# Altium schematic sheet STM32_Breakout.SchDoc
size 558 x 431 mm
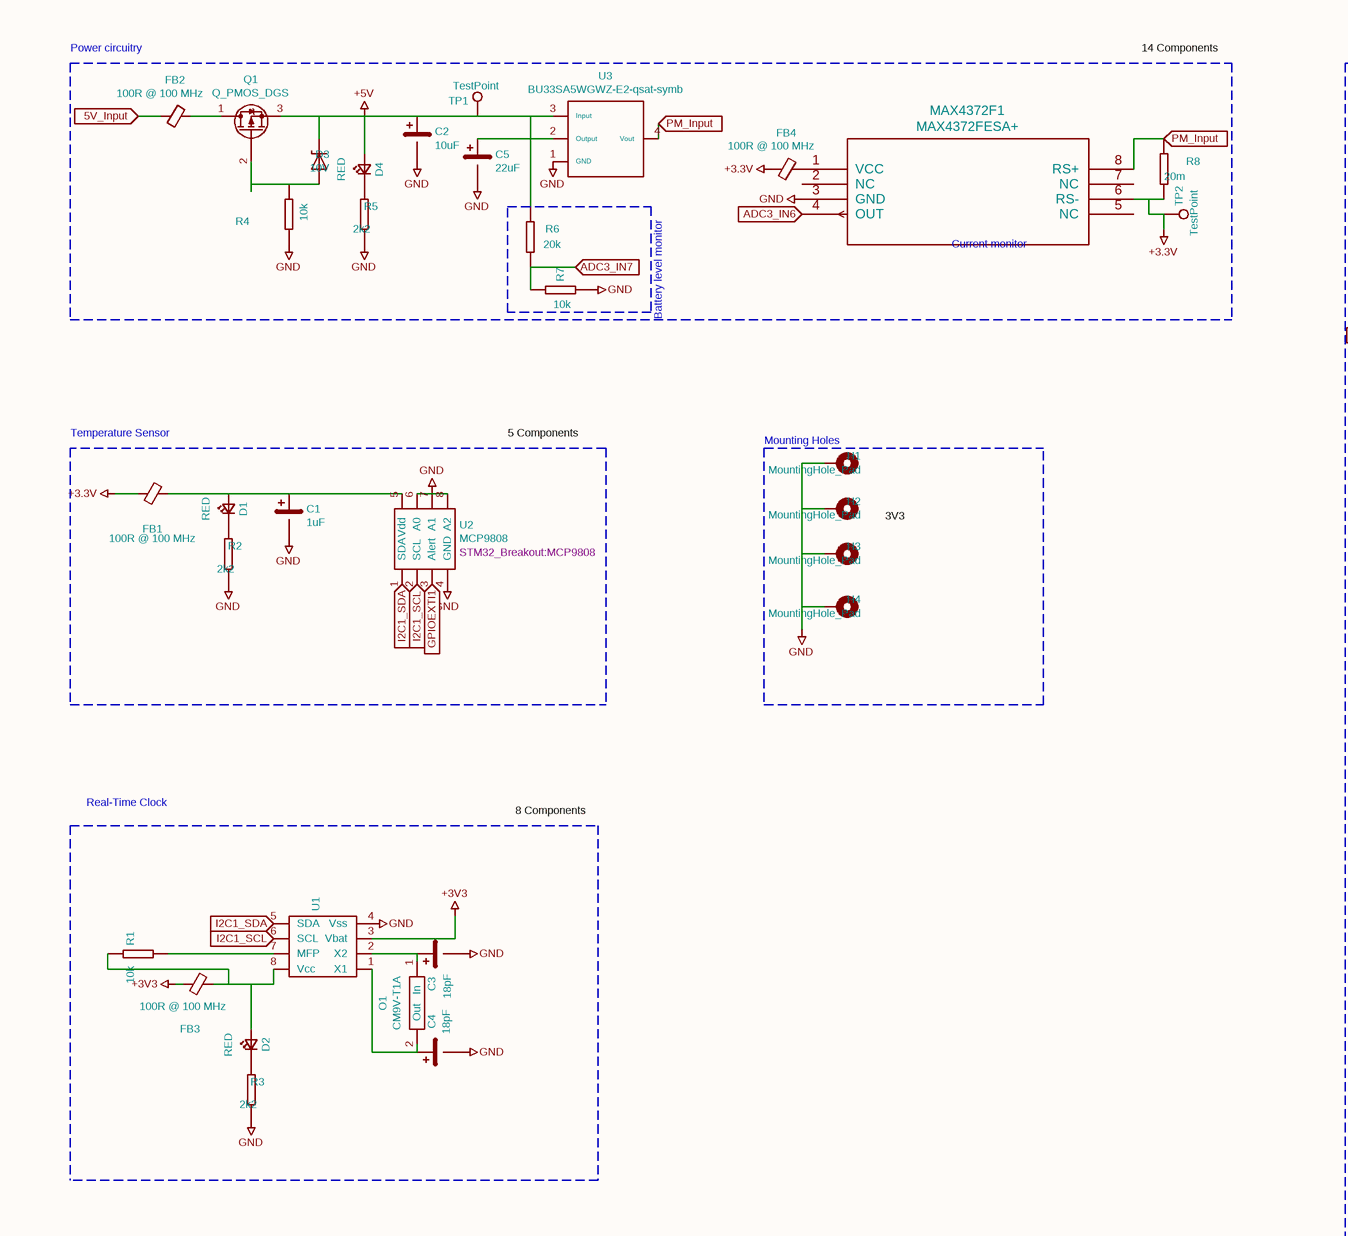
[diagram p0: STM32_Breakout.SchDoc, top left]
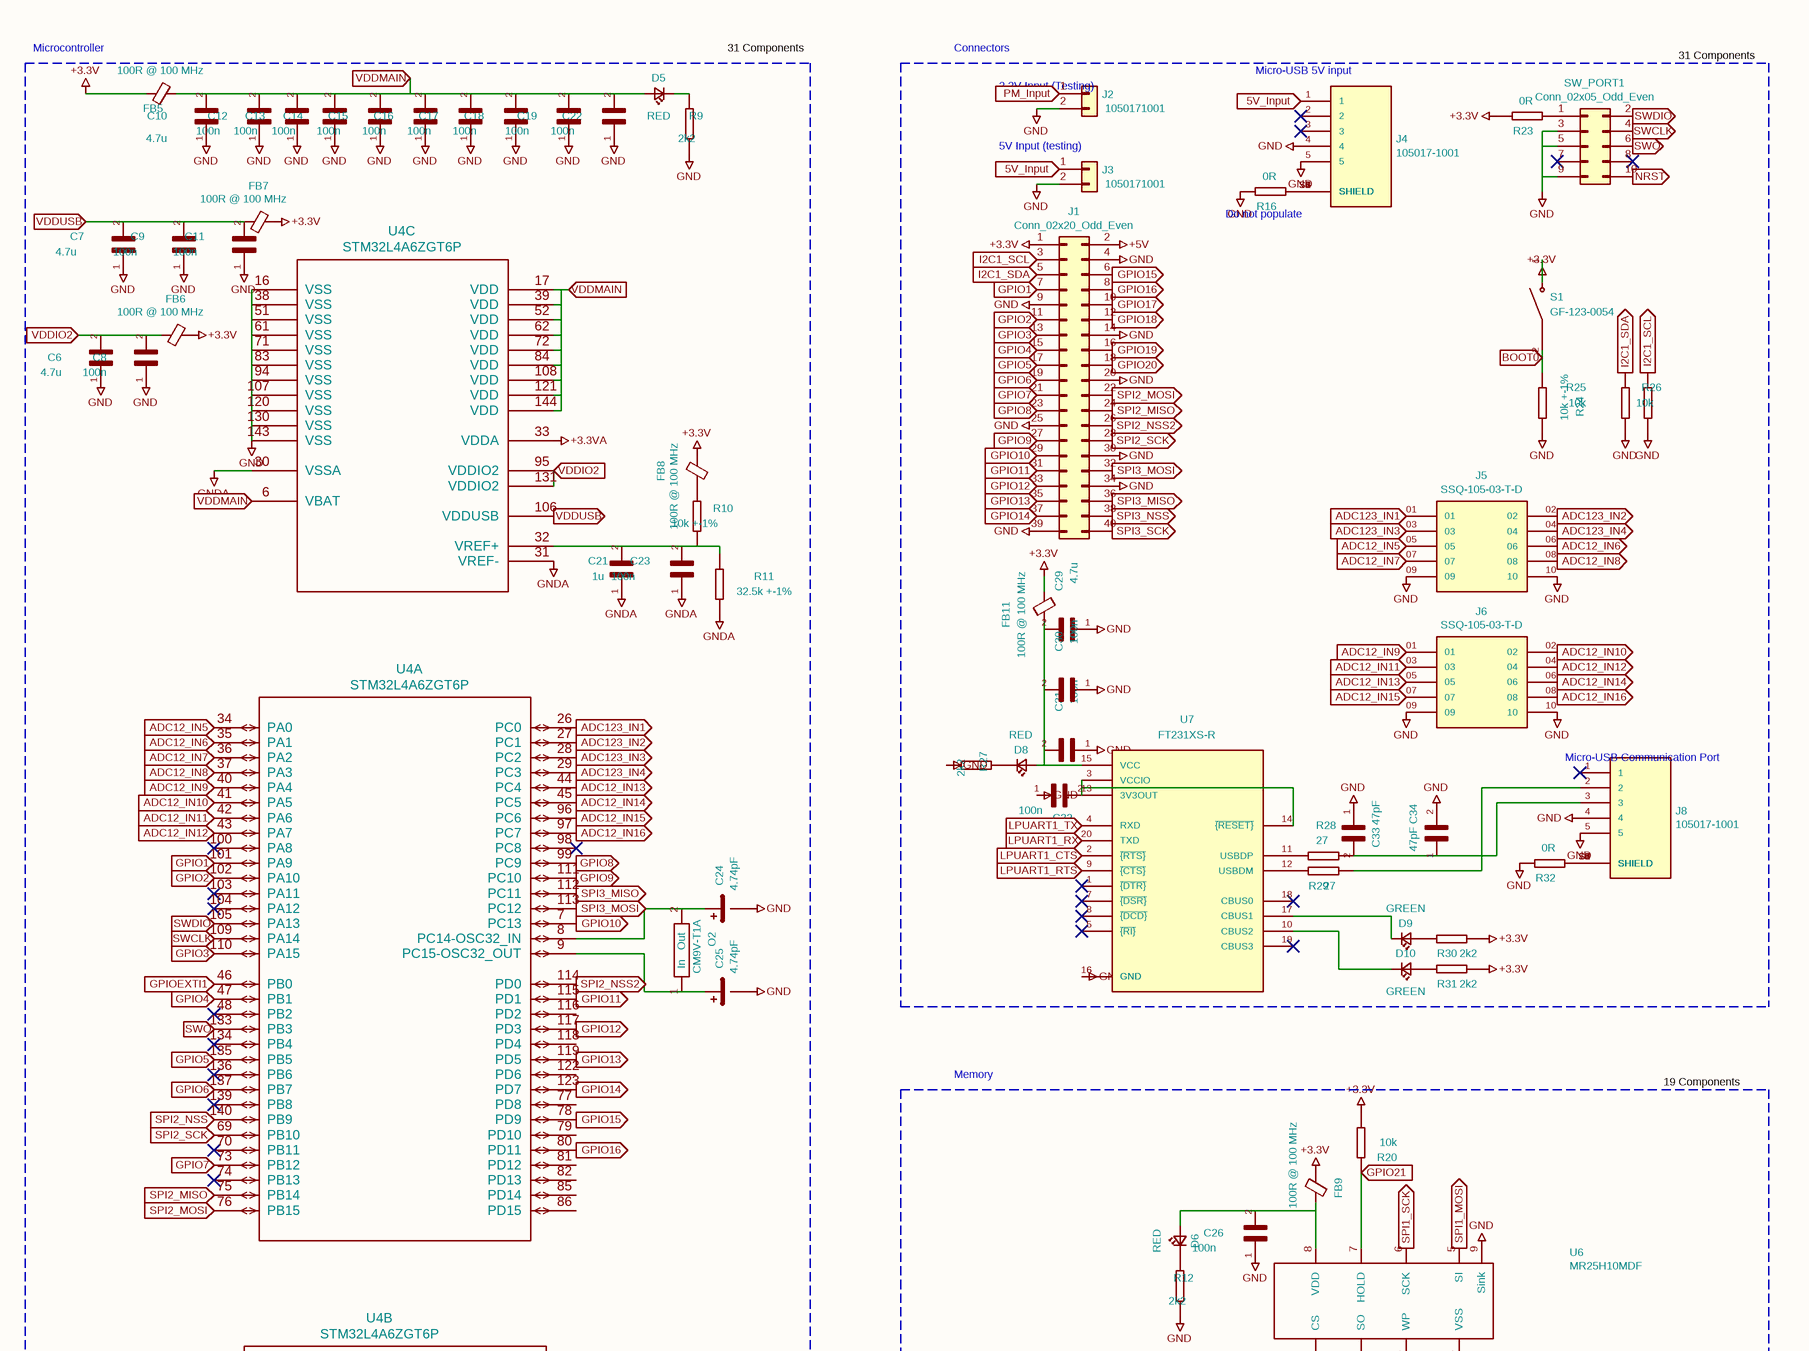
[diagram p1: STM32_Breakout.SchDoc, top right]
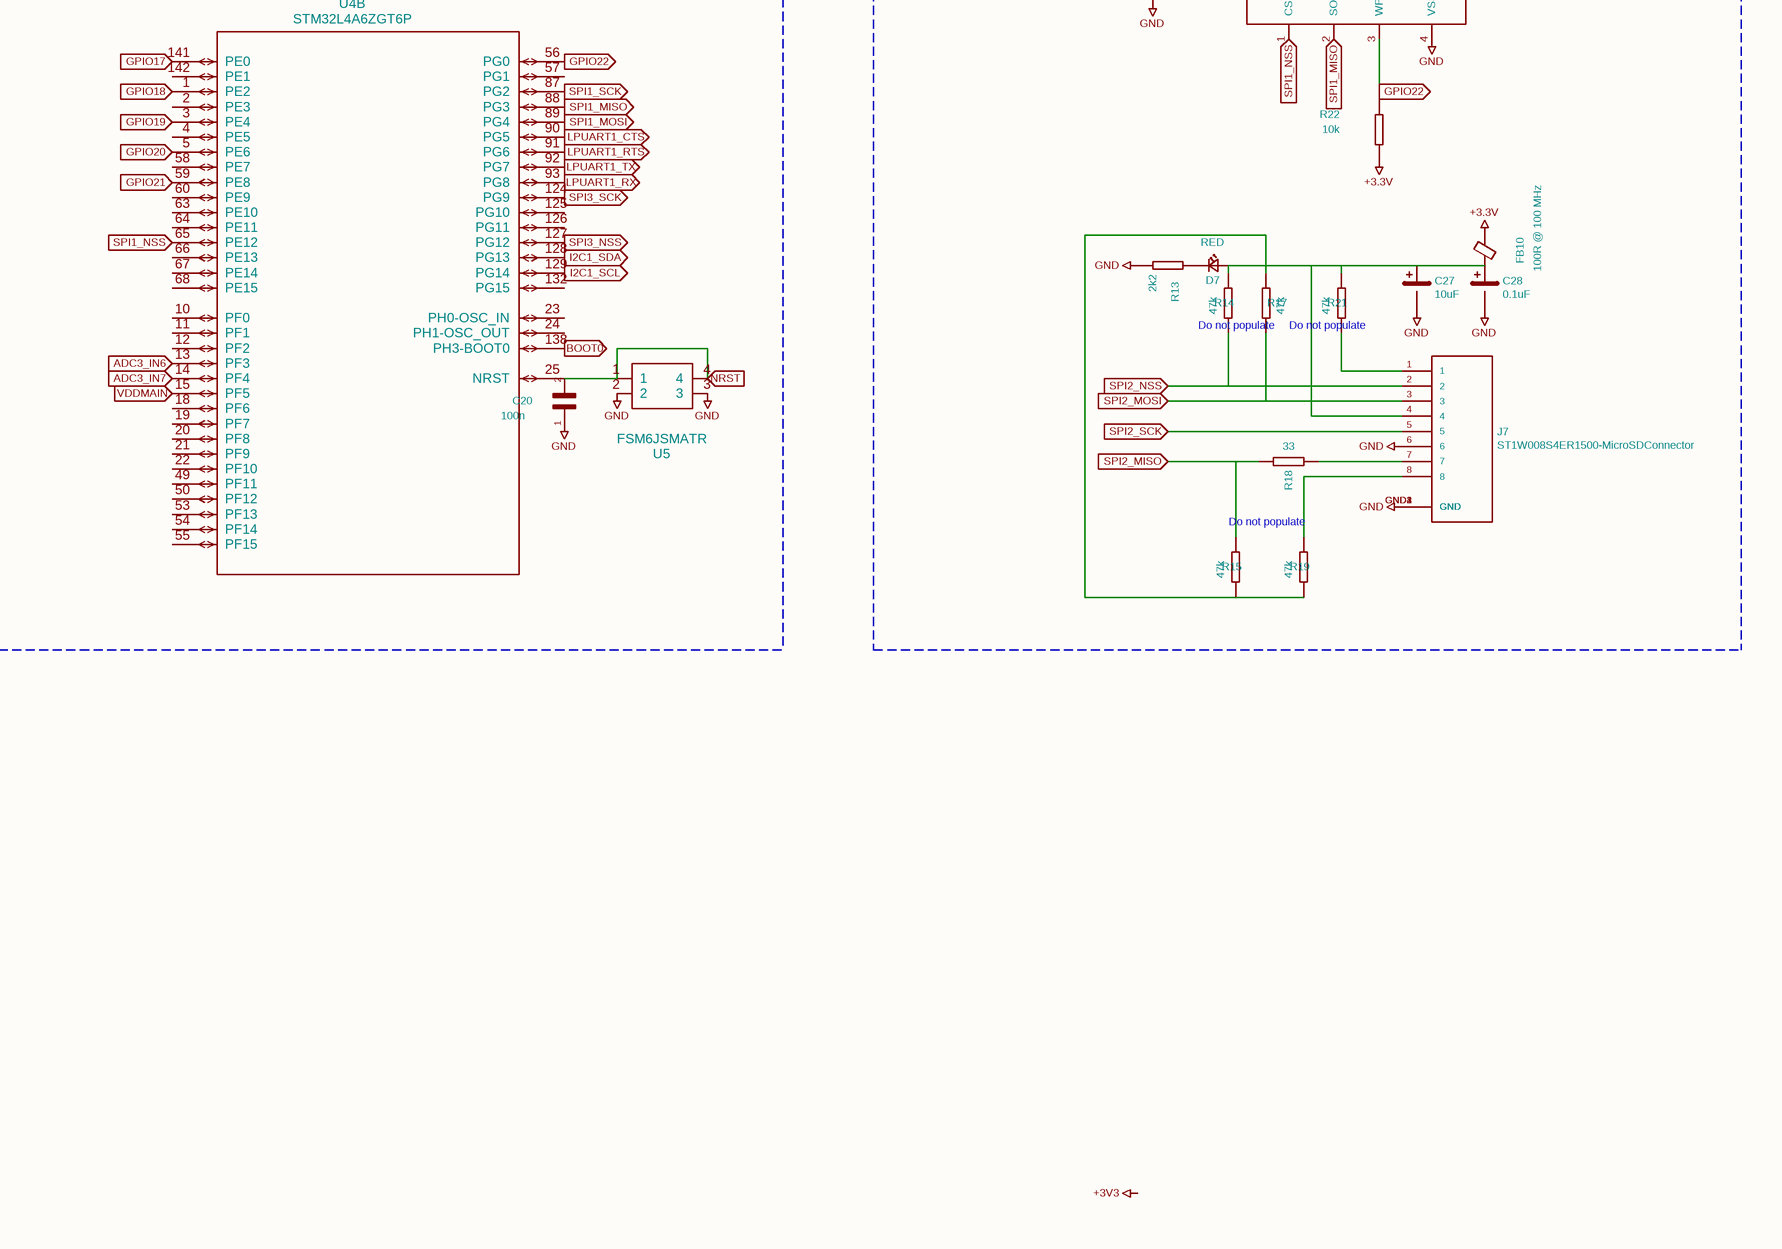
[diagram p2: STM32_Breakout.SchDoc, bottom right]

## Parts
C1  1uF  [CAPC1608X90]
C2  10uF  [CAPC1608X90]
C3  18pF  [CAPC1608X90]
C4  18pF  [CAPC1608X90]
C5  22uF  [CAPC1608X90]
C6  4.7u  [CAPC1608X90]
C7  4.7u  [CAPC1608X90]
C8  100n  [CAPC1608X90]
C9  100n  [CAPC1608X90]
C10  4.7u  [CAPC1608X90]
C11  100n  [CAPC1608X90]
C12  100n  [CAPC1608X90]
C13  100n  [CAPC1608X90]
C14  100n  [CAPC1608X90]
C15  100n  [CAPC1608X90]
C16  100n  [CAPC1608X90]
C17  100n  [CAPC1608X90]
C18  100n  [CAPC1608X90]
C19  100n  [CAPC1608X90]
C20  100n  [CAPC1608X90]
C21  1u  [CAPC1608X90]
C22  100n  [CAPC1608X90]
C23  100n  [CAPC1608X90]
C24  4.74pF  [CAPC1608X90]
C25  4.74pF  [CAPC1608X90]
C26  100n  [CAPC1608X90]
C27  10uF  [CAPC1608X90]
C28  0.1uF  [CAPC1608X90]
C29  4.7u  [CAPC1608X90]
C30  100n  [CAPC1608X90]
C31  100n  [CAPC1608X90]
C32  100n  [CAPC1608X90]
C33  47pF  [CAPC1608X90]
C34  47pF  [CAPC1608X90]
D1  RED  [LED_0603_1608Metric_Pad1.05x0.95mm_HandSolder]
D2  RED  [LED_0603_1608Metric_Pad1.05x0.95mm_HandSolder]
D3  10V  [SOT91P240X110-3N]
D4  RED  [LED_0603_1608Metric_Pad1.05x0.95mm_HandSolder]
D5  RED  [LED_0603_1608Metric_Pad1.05x0.95mm_HandSolder]
D6  RED  [LED_0603_1608Metric_Pad1.05x0.95mm_HandSolder]
D7  RED  [LED_0603_1608Metric_Pad1.05x0.95mm_HandSolder]
D8  RED  [LED_0603_1608Metric_Pad1.05x0.95mm_HandSolder]
D9  GREEN  [LED_0603_1608Metric_Pad1.05x0.95mm_HandSolder]
D10  GREEN  [LED_0603_1608Metric_Pad1.05x0.95mm_HandSolder]
FB1  100R @ 100 MHz  [INDUC1607X60N]
FB2  100R @ 100 MHz  [INDUC1607X60N]
FB3  100R @ 100 MHz  [INDUC1607X60N]
FB4  100R @ 100 MHz  [INDUC1607X60N]
FB5  100R @ 100 MHz  [INDUC1607X60N]
FB6  100R @ 100 MHz  [INDUC1607X60N]
FB7  100R @ 100 MHz  [INDUC1607X60N]
FB8  100R @ 100 MHz  [INDUC1607X60N]
FB9  100R @ 100 MHz  [INDUC1607X60N]
FB10  100R @ 100 MHz  [INDUC1607X60N]
FB11  100R @ 100 MHz  [INDUC1607X60N]
H1  MountingHole_Pad  [MountingHole_4.3mm_M4_Pad_Via]
H2  MountingHole_Pad  [MountingHole_4.3mm_M4_Pad_Via]
H3  MountingHole_Pad  [MountingHole_4.3mm_M4_Pad_Via]
H4  MountingHole_Pad  [MountingHole_4.3mm_M4_Pad_Via]
J1  Conn_02x20_Odd_Even  [PinHeader_2x20_P2.54mm_Vertical]
J2  1050171001  [PinHeader_1x02_P2.54mm_Vertical]
J3  1050171001  [PinHeader_1x02_P2.54mm_Vertical]
J4  105017-1001  [MOLEX_105017-1001]
J5  SSQ-105-03-T-D  [SAMTEC_SSQ-105-03-T-D]
J6  SSQ-105-03-T-D  [SAMTEC_SSQ-105-03-T-D]
J7  ST1W008S4ER1500-MicroSDConnector  [JAE_ST1W008S4ER1500]
J8  105017-1001  [MOLEX_105017-1001]
MAX4372F1  MAX4372FESA+  [SOIC127P600X175-8N]
O1  CM9V-T1A  [CM9V-T1A]
O2  CM9V-T1A  [CM9V-T1A]
Q1  Q_PMOS_DGS  [SOT91P240X110-3N]
R1  10k  [RESC1607X60N]
R2  2k2  [RESC1607X60N]
R3  2k2  [RESC1607X60N]
R4  10k  [RESC1607X60N]
R5  2k2  [RESC1607X60N]
R6  20k  [RESC1607X60N]
R7  10k  [RESC1607X60N]
R8  20m  [RESC1607X60N]
R9  2k2  [RESC1607X60N]
R10  10k +-1%  [RESC1607X60N]
R11  32.5k +-1%  [RESC1607X60N]
R12  2k2  [RESC1607X60N]
R13  2k2  [RESC1607X60N]
R14  47k  [RESC1607X60N]
R15  47k  [RESC1607X60N]
R16  0R  [RESC1607X60N]
R17  47k  [RESC1607X60N]
R18  33  [RESC1607X60N]
R19  47k  [RESC1607X60N]
R20  10k  [RESC1607X60N]
R21  47k  [RESC1607X60N]
R22  10k  [RESC1607X60N]
R23  0R  [RESC1607X60N]
R24  10k +-1%  [RESC1607X60N]
R25  10k  [RESC1607X60N]
R26  10k  [RESC1607X60N]
R27  2k2  [RESC1607X60N]
R28  27  [RESC1607X60N]
R29  27  [RESC1607X60N]
R30  2k2  [RESC1607X60N]
R31  2k2  [RESC1607X60N]
R32  0R  [RESC1607X60N]
S1  GF-123-0054  [SW_GF-123-0054]
SW_PORT1  Conn_02x05_Odd_Even  [PinHeader_2x05_P1.27mm_Vertical_SMD]
TP1  TestPoint  [TestPoint_Pad_D2.0mm]
TP2  TestPoint  [TestPoint_Pad_D2.0mm]
U1  MCP7940NT-I_MS  [MCP7940NT-I-MS]  (value not drawn)
U2  Footprint: STM32_Breakout:MCP9808  [MCP9808]  (hidden comment: MCP9808)
U3  BU33SA5WGWZ-E2-qsat-symb  [BU33SA5WGWZ-E2]
U4  STM32L4A6ZGT6P  [LQFP144-20x20mm]  (parts A,B,C of 3)
U5  FSM6JSMATR  [FSM6JSMATR]
U6  MR25H10MDF  [SON65P300X300X95-8N]
U7  FT231XS-R  [SOP63P599X175-20N]

## Blocks framed on the sheet
Microcontroller /: C6-C25 D5 FB5-FB8 O2 R9-R11 U4 U5
Temperature Sensor /: C1 D1 FB1 R2 U2
Mounting Holes /: H1-H4

## Ports
5V_Input (in), ADC3_IN6 (in), ADC3_IN7 (in), ADC12_IN5 (in), ADC12_IN6 (in), ADC12_IN7 (in), ADC12_IN8 (in), ADC12_IN9 (in), ADC12_IN10 (in), ADC12_IN11 (in), ADC12_IN12 (in), ADC12_IN13 (in), ADC12_IN14 (in), ADC12_IN15 (in), ADC12_IN16 (in), ADC123_IN1 (in), ADC123_IN2 (in), ADC123_IN3 (in), ADC123_IN4 (in), BOOT0 (in), GPIO1 (in), GPIO2 (in), GPIO3 (in), GPIO4 (in), GPIO5 (in), GPIO6 (in), GPIO7 (in), GPIO8 (in), GPIO9 (in), GPIO10 (in), GPIO11 (in), GPIO12 (in), GPIO13 (in), GPIO14 (in), GPIO15 (in), GPIO16 (in), GPIO17 (in), GPIO18 (in), GPIO19 (in), GPIO20 (in), GPIO21 (in), GPIO22 (in), GPIOEXTI1 (in), I2C1_SCL (in), I2C1_SDA (in), LPUART1_CTS (in), LPUART1_RTS (in), LPUART1_RX (in), LPUART1_TX (in), NRST (in), PM_Input (in), SPI1_MISO (in), SPI1_MOSI (in), SPI1_NSS (in), SPI1_SCK (in), SPI2_MISO (in), SPI2_MOSI (in), SPI2_NSS2 (in), SPI2_NSS (in), SPI2_SCK (in), SPI3_MISO (in), SPI3_MOSI (in), SPI3_NSS (in), SPI3_SCK (in), SWCLK (in), SWDIO (in), SWO (in), VDDIO2 (in), VDDMAIN (in), VDDUSB (in)

## Nets
+3.3V: FB1.1 FB4.2 FB5.2 FB6.1 FB7.1 FB8.1 FB9.1 FB10.2 FB11.1 J1.1(Pin_1) MAX4372F1.6(RS-) R8.2 R20.2 R22.2 R23.2 R30.2 R31.2 S1.1 TP2.1
+3.3VA: U4.33(VDDA)
+3V3: FB3.1 U1.3(Vbat)
+5V: C2.1 D3.3(A) D4.2(A) J1.2(Pin_2) Q1.3(S) R6.2 TP1.1 U3.3(Input)
GND: C1.2 C2.2 C3.2 C4.2 C5.2 C6.1 C7.1 C8.1 C9.1 C10.1 C11.1 C12.1 C13.1 C14.1 C15.1 C16.1 C17.1 C18.1 C19.1 C20.1 C22.1 C24.2 C25.2 C26.1 C27.2 C28.2 C29.1 C30.1 C31.1 C32.1 C33.1 C34.2 H1.1 H2.1 H3.1 H4.1 J1.4(Pin_4) J1.9(Pin_9) J1.14(Pin_14) J1.20(Pin_20) J1.25(Pin_25) J1.30(Pin_30) J1.34(Pin_34) J1.39(Pin_39) J2.2(Pin_2) J3.2(Pin_2) J4.4 J4.5 J5.09 J5.10 J6.09 J6.10 J7.6 J7.GND1(GND) J7.GND2(GND) J7.GND3(GND) J7.GND4(GND) J8.4 J8.5 MAX4372F1.3(GND) R2.2 R3.2 R4.1 R5.2 R7.2 R9.2 R12.2 R13.2 R16.2 R24.2 R25.2 R26.2 R27.2 R32.2 SW_PORT1.3(Pin_3) SW_PORT1.5(Pin_5) SW_PORT1.9(Pin_9) U1.4(Vss) U2.4(GND) U2.6(A0) U2.7(A1) U2.8(A2) U3.1(GND) U4.16(VSS) U4.38(VSS) U4.51(VSS) U4.61(VSS) U4.71(VSS) U4.83(VSS) U4.94(VSS) U4.107(VSS) U4.120(VSS) U4.130(VSS) U4.143(VSS) U5.2 U5.3 U6.4(VSS) U6.9(Sink) U7.6(GND) U7.16(GND)
GNDA: C21.1 C23.1 R11.1 U4.30(VSSA) U4.31(VREF-)
5V_Input: FB2.2 J3.1(Pin_1) J4.1 ; port 5V_Input
ADC3_IN6: MAX4372F1.4(OUT) U4.13(PF3) ; port ADC3_IN6
ADC3_IN7: R6.1 R7.1 U4.14(PF4) ; port ADC3_IN7
ADC12_IN5: J5.05 U4.34(PA0) ; port ADC12_IN5
ADC12_IN6: J5.06 U4.35(PA1) ; port ADC12_IN6
ADC12_IN7: J5.07 U4.36(PA2) ; port ADC12_IN7
ADC12_IN8: J5.08 U4.37(PA3) ; port ADC12_IN8
ADC12_IN9: J6.01 U4.40(PA4) ; port ADC12_IN9
ADC12_IN10: J6.02 U4.41(PA5) ; port ADC12_IN10
ADC12_IN11: J6.03 U4.42(PA6) ; port ADC12_IN11
ADC12_IN12: J6.04 U4.43(PA7) ; port ADC12_IN12
ADC12_IN13: J6.05 U4.44(PC4) ; port ADC12_IN13
ADC12_IN14: J6.06 U4.45(PC5) ; port ADC12_IN14
ADC12_IN15: J6.07 U4.96(PC6) ; port ADC12_IN15
ADC12_IN16: J6.08 U4.97(PC7) ; port ADC12_IN16
ADC123_IN1: J5.01 U4.26(PC0) ; port ADC123_IN1
ADC123_IN2: J5.02 U4.27(PC1) ; port ADC123_IN2
ADC123_IN3: J5.03 U4.28(PC2) ; port ADC123_IN3
ADC123_IN4: J5.04 U4.29(PC3) ; port ADC123_IN4
BOOT0: R24.1 S1.2 U4.138(PH3-BOOT0) ; port BOOT0
GPIO1: J1.7(Pin_7) U4.101(PA9) ; port GPIO1
GPIO2: J1.11(Pin_11) U4.102(PA10) ; port GPIO2
GPIO3: J1.13(Pin_13) U4.110(PA15) ; port GPIO3
GPIO4: J1.15(Pin_15) U4.47(PB1) ; port GPIO4
GPIO5: J1.17(Pin_17) U4.135(PB5) ; port GPIO5
GPIO6: J1.19(Pin_19) U4.137(PB7) ; port GPIO6
GPIO7: J1.21(Pin_21) U4.73(PB12) ; port GPIO7
GPIO8: J1.23(Pin_23) U4.99(PC9) ; port GPIO8
GPIO9: J1.27(Pin_27) U4.111(PC10) ; port GPIO9
GPIO10: J1.29(Pin_29) U4.7(PC13) ; port GPIO10
GPIO11: J1.31(Pin_31) U4.115(PD1) ; port GPIO11
GPIO12: J1.33(Pin_33) U4.117(PD3) ; port GPIO12
GPIO13: J1.35(Pin_35) U4.119(PD5) ; port GPIO13
GPIO14: J1.37(Pin_37) U4.123(PD7) ; port GPIO14
GPIO15: J1.6(Pin_6) U4.78(PD9) ; port GPIO15
GPIO16: J1.8(Pin_8) U4.80(PD11) ; port GPIO16
GPIO17: J1.10(Pin_10) U4.141(PE0) ; port GPIO17
GPIO18: J1.12(Pin_12) U4.1(PE2) ; port GPIO18
GPIO19: J1.16(Pin_16) U4.3(PE4) ; port GPIO19
GPIO20: J1.18(Pin_18) U4.5(PE6) ; port GPIO20
GPIO21: R20.1 U4.59(PE8) U6.7(HOLD) ; port GPIO21
GPIO22: R22.1 U4.56(PG0) U6.3(WP) ; port GPIO22
GPIOEXTI1: U2.3(Alert) U4.46(PB0) ; port GPIOEXTI1
I2C1_SCL: J1.3(Pin_3) R26.1 U1.6(SCL) U2.2(SCL) U4.129(PG14) ; port I2C1_SCL
I2C1_SDA: J1.5(Pin_5) R25.1 U1.5(SDA) U2.1(SDA) U4.128(PG13) ; port I2C1_SDA
LPUART1_CTS: U4.90(PG5) U7.2(~{{RTS}}) ; port LPUART1_CTS
LPUART1_RTS: U4.91(PG6) U7.9(~{{CTS}}) ; port LPUART1_RTS
LPUART1_RX: U4.93(PG8) U7.20(TXD) ; port LPUART1_RX
LPUART1_TX: U4.92(PG7) U7.4(RXD) ; port LPUART1_TX
NRST: C20.2 SW_PORT1.10(Pin_10) U4.25(NRST) U5.1 U5.4 ; port NRST
PM_Input: J2.1(Pin_1) MAX4372F1.8(RS+) R8.1 U3.4(Vout) ; port PM_Input
SPI1_MISO: U4.88(PG3) U6.2(SO) ; port SPI1_MISO
SPI1_MOSI: U4.89(PG4) U6.5(SI) ; port SPI1_MOSI
SPI1_NSS: U4.65(PE12) U6.1(CS) ; port SPI1_NSS
SPI1_SCK: U4.87(PG2) U6.6(SCK) ; port SPI1_SCK
SPI2_MISO: J1.24(Pin_24) R15.1 R18.2 U4.75(PB14) ; port SPI2_MISO
SPI2_MOSI: J1.22(Pin_22) J7.3 R17.2 U4.76(PB15) ; port SPI2_MOSI
SPI2_NSS: J7.2 R14.2 U4.140(PB9) ; port SPI2_NSS
SPI2_NSS2: J1.26(Pin_26) U4.114(PD0) ; port SPI2_NSS2
SPI2_SCK: J1.28(Pin_28) J7.5 U4.69(PB10) ; port SPI2_SCK
SPI3_MISO: J1.36(Pin_36) U4.112(PC11) ; port SPI3_MISO
SPI3_MOSI: C24.1 J1.32(Pin_32) O2.2(Out) U4.8(PC14-OSC32_IN) U4.113(PC12) ; port SPI3_MOSI
SPI3_NSS: J1.38(Pin_38) U4.127(PG12) ; port SPI3_NSS
SPI3_SCK: J1.40(Pin_40) U4.124(PG9) ; port SPI3_SCK
SWCLK: SW_PORT1.4(Pin_4) U4.109(PA14) ; port SWCLK
SWDIO: SW_PORT1.2(Pin_2) U4.105(PA13) ; port SWDIO
SWO: SW_PORT1.6(Pin_6) U4.133(PB3) ; port SWO
VDDIO2: C6.2 C8.2 FB6.2 U4.95(VDDIO2) U4.131(VDDIO2) ; port VDDIO2
VDDMAIN: C10.2 C12.2 C13.2 C14.2 C15.2 C16.2 C17.2 C18.2 C19.2 C22.2 D5.2(A) FB5.1 U4.6(VBAT) U4.15(PF5) U4.17(VDD) U4.39(VDD) U4.52(VDD) U4.62(VDD) U4.72(VDD) U4.84(VDD) U4.108(VDD) U4.121(VDD) U4.144(VDD) ; port VDDMAIN
VDDUSB: C7.2 C9.2 C11.2 FB7.2 U4.106(VDDUSB) ; port VDDUSB
NetC1_1: C1.1 D1.2(A) FB1.2 U2.5(Vdd)
NetC3_1: C3.1 O1.1(In) U1.2(X2)
NetC4_1: C4.1 O1.2(Out) U1.1(X1)
NetC5_1: C5.1 U3.2(Output)
NetC21_2: C21.2 C23.2 R10.2 R11.2 U4.32(VREF+)
NetC25_1: C25.1 O2.1(In) U4.9(PC15-OSC32_OUT)
NetC26_2: C26.2 D6.2(A) FB9.2 U6.8(VDD)
NetC27_1: C27.1 C28.1 D7.2(A) FB10.1 J7.4 R14.1 R15.2 R17.1 R19.2 R21.1
NetC29_2: C29.2 C30.2 C31.2 D8.2(A) FB11.2 U7.15(VCC)
NetC32_2: C32.2 U7.3(VCCIO) U7.13(3V3OUT) U7.14(~{{RESET}})
NetC33_2: C33.2 C34.1 J8.3 R28.2
NetD1_1: D1.1(K) R2.1
NetD2_1: D2.1(K) R3.1
NetD2_2: D2.2(A) FB3.2 R1.1 U1.8(Vcc)
NetD3_1: D3.1(K) Q1.2(G) R4.2
NetD4_1: D4.1(K) R5.1
NetD5_1: D5.1(K) R9.1
NetD6_1: D6.1(K) R12.1
NetD7_1: D7.1(K) R13.1
NetD8_1: D8.1(K) R27.1
NetD9_1: D9.1(K) U7.17(CBUS1)
NetD9_2: D9.2(A) R30.1
NetD10_1: D10.1(K) U7.10(CBUS2)
NetD10_2: D10.2(A) R31.1
NetFB2_1: FB2.1 Q1.1(D)
NetFB4_1: FB4.1 MAX4372F1.1(VCC)
NetFB8_2: FB8.2 R10.1
NetJ4_S1: J4.S1(SHIELD) J4.S2(SHIELD) J4.S3(SHIELD) J4.S4(SHIELD) J4.S5(SHIELD) J4.S6(SHIELD) R16.1
NetJ7_1: J7.1 R21.2
NetJ7_7: J7.7 R18.1
NetJ7_8: J7.8 R19.1
NetJ8_2: J8.2 R29.2
NetJ8_S1: J8.S1(SHIELD) J8.S2(SHIELD) J8.S3(SHIELD) J8.S4(SHIELD) J8.S5(SHIELD) J8.S6(SHIELD) R32.1
NetR1_2: R1.2 U1.7(MFP)
NetR23_1: R23.1 SW_PORT1.1(Pin_1)
NetR28_1: R28.1 U7.11(USBDP)
NetR29_1: R29.1 U7.12(USBDM)

Not connected (* = marked no-connect by the designer): J4 2* 3*; J8 1*; MAX4372F1 2(NC) 5(NC) 7(NC); SW_PORT1 7(Pin_7)* 8(Pin_8)*; U4 2(PE3) 4(PE5) 10(PF0) 11(PF1) 12(PF2) 18(PF6) 19(PF7) 20(PF8) 21(PF9) 22(PF10) 23(PH0-OSC_IN) 24(PH1-OSC_OUT) 48(PB2)* 49(PF11) 50(PF12) 53(PF13) 54(PF14) 55(PF15) 57(PG1) 58(PE7) 60(PE9) 63(PE10) 64(PE11) 66(PE13) 67(PE14) 68(PE15) 70(PB11)* 74(PB13)* 77(PD8) 79(PD10) 81(PD12) 82(PD13) 85(PD14) 86(PD15) 98(PC8)* 100(PA8)* 103(PA11)* 104(PA12)* 116(PD2) 118(PD4) 122(PD6) 125(PG10) 126(PG11) 132(PG15) 134(PB4)* 136(PB6)* 139(PB8)* 142(PE1); U7 1(~{{DTR}})* 5(~{{RI}})* 7(~{{DSR}})* 8(~{{DCD}})* 18(CBUS0)* 19(CBUS3)*

## Notes on the sheet
- Power circuitry
- Connectors
- (near J4) Micro-USB 5V input
- (near J2) 3.3V Input (Testing)
- (near J3) 5V Input (testing)
- Do not populate
- (near MAX4372F1) Current monitor
- (near U3) Battery level monitor
- Real-Time Clock
- (near J8) Micro-USB Communication Port
- Memory
- (near R21) Do not populate
- Labels drawn without touching a wire or pin: 3V3, 5 Components, 8 Components, 14 Components, 19 Components, 31 Components, +3V3
- 1
- 2
- 3
- 4
- 5
- 6
- 7
- 8
- 9
- 10
- 11
- A
- B
- C
- D
- E
- F
- G
- H
- Title:
- File: STM32_Breakout.kicad_sch
- Sheet: /
- KiCad E.D.A.  kicad (5.1.4)-1
- Size: C
- Date:
- Rev:
- Id: 1/1

## Library data of the parts
C1-C5 C24 C25 C27 C28 = CP1: Footprint: STM32_Breakout:CAPC1608X90
  C1: Value: 1uF
  C2 C27: Value: 10uF
  C3 C4: Value: 18pF
  C5: Value: 22uF
  C24 C25: Value: 4.74pF
  C28: Value: 0.1uF
C6-C23 C26 C29-C34 = CC0603MRX5R5BB475-CC0603MRX5R5BB475
  C6 C7 C10 C29: Value: 4.7u
  C8 C9 C11-C20 C22 C23 C26 C30-C32: Value: 100n
  C21: Value: 1u
  C33 C34: Value: 47pF
D1 D2 D4-D10 = LED_Small: Footprint: LED_SMD:LED_0603_1608Metric_Pad1.05x0.95mm_HandSolder
  D1 D2 D4-D8: Value: RED
  D9 D10: Value: GREEN
D3 = D_Zener: Value: 10V; Footprint: STM32_Breakout:SOT91P240X110-3N
FB1-FB11 = Ferrite_Bead_Small: Value: 100R @ 100 MHz; Footprint: STM32_Breakout:INDUC1607X60N
J2 J3 = Conn_01x02: Value: 1050171001; Footprint: Connector_PinHeader_2.54mm:PinHeader_1x02_P2.54mm_Vertical
J4 J8 = 105017-1001-Imported_OBC_Library: MANUFACTURER: MOLEX; MAXIMUM_PACKAGE_HIEGHT: 2.9mm; PARTREV: F; STANDARD: Manufacturer Recommendations; Value: 105017-1001; Footprint: STM32_Breakout:MOLEX_105017-1001
J5 J6 = SSQ-105-03-T-D-Imported_OBC_Library: MANUFACTURER: Samtec; PARTREV: R; STANDARD: Manufacturer Recommendations; Value: SSQ-105-03-T-D; Footprint: STM32_Breakout:SAMTEC_SSQ-105-03-T-D
J7 = ST1W008S4ER1500-MicroSDConnector-Imported_OBC_Library: MANUFACTURER: JAE Electronics; PARTREV: 2; MAXIMUM_PACKAGE_HEIGHT: 2.0 mm; STANDARD: Manufacturer Recommendations; Value: ST1W008S4ER1500-MicroSDConnector; Footprint: STM32_Breakout:JAE_ST1W008S4ER1500
MAX4372F1 = MAX4372FESA+-MAX4372FESA+: Value: MAX4372FESA+; Footprint: STM32_Breakout:SOIC127P600X175-8N
O1 O2 = CM9V-T1A-Imported_OBC_Library: Value: CM9V-T1A; Footprint: STM32_Breakout:CM9V-T1A
R1-R32 = R0603-OBC_Libary
  R1 R20 R22 R25 R26: Value: 10k
  R2 R3 R5 R9 R12 R13 R27 R30 R31: Value: 2k2
  R4 R7: Value: 10k; Footprint: STM32_Breakout:RESC1607X60N
  R6: Value: 20k
  R8: Value: 20m
  R10 R24: Value: 10k +-1%
  R11: Value: 32.5k +-1%
  R14 R15 R17 R19 R21: Value: 47k
  R16 R23 R32: Value: 0R
  R18: Value: 33
  R28 R29: Value: 27
S1 = GF-123-0054: MANUFACTURER: CW Industries; MAXIMUM_PACKAGE_HIEGHT: 14.96 mm; PARTREV: May 20, 2003; STANDARD: Manufacturer Recommendations; Value: GF-123-0054
U1 = MCP7940NT-I_MS-Imported_OBC_Library: Value: MCP7940NT-I_MS; Footprint: STM32_Breakout:MCP7940NT-I-MS
U2 = MCP9808-Imported_OBC_Library: Value: MCP9808
U3 = BU33SA5WGWZ-E2-qsat-symb-Imported_OBC_Library: Value: BU33SA5WGWZ-E2-qsat-symb; Footprint: STM32_Breakout:BU33SA5WGWZ-E2
U4 = STM32L4A6ZGT6P-STM32L4A6ZGT6P: Value: STM32L4A6ZGT6P
U5 = FSM6JSMATR-Imported_OBC_Library: Value: FSM6JSMATR; Footprint: STM32_Breakout:FSM6JSMATR
U6 = MR25H10MDF-MRAM_Symbol: Value: MR25H10MDF; Footprint: STM32_Breakout:SON65P300X300X95-8N
U7 = FT231XS-R: MANUFACTURER: FTDI; PARTREV: 1.2; STANDARD: IPC 7351B; Value: FT231XS-R
H1-H4 = MountingHole_Pad: Value: MountingHole_Pad; Footprint: MountingHole:MountingHole_4.3mm_M4_Pad_Via
J1 = Conn_02x20_Odd_Even: Value: Conn_02x20_Odd_Even; Footprint: Connector_PinHeader_2.54mm:PinHeader_2x20_P2.54mm_Vertical
Q1 = Q_PMOS_DGS: Value: Q_PMOS_DGS; Footprint: STM32_Breakout:SOT91P240X110-3N
SW_PORT1 = Conn_02x05_Odd_Even: Value: Conn_02x05_Odd_Even; Footprint: Connector_PinHeader_1.27mm:PinHeader_2x05_P1.27mm_Vertical_SMD
TP1 TP2 = TestPoint: Value: TestPoint; Footprint: TestPoint:TestPoint_Pad_D2.0mm